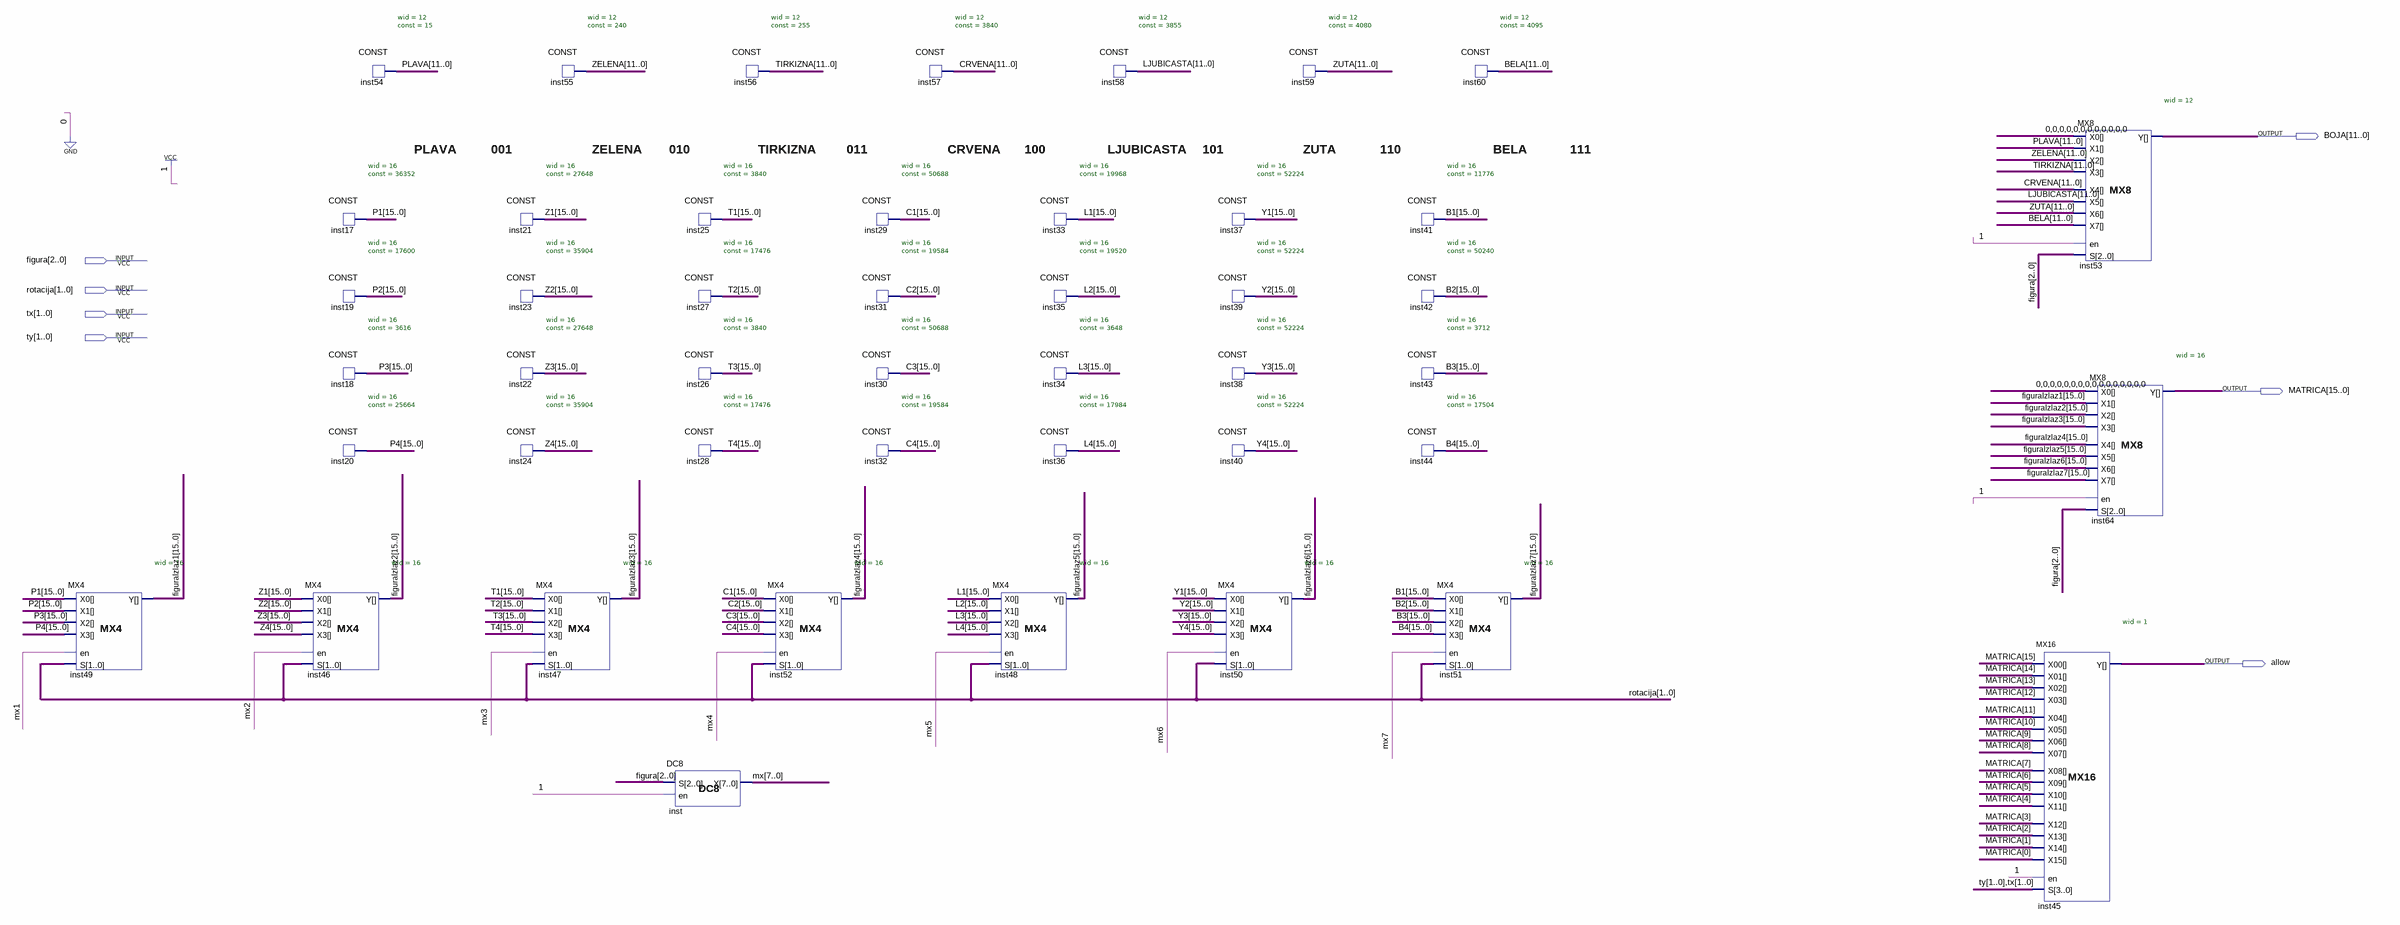
[diagram p0: schematic sheet]
// Quartus schematic Tetrimini.bdf as structural Verilog: 46 symbols, 7 pins
module Tetrimini (
  input  [2:0] figura,
  input  [1:0] rotacija,
  input  [1:0] tx,
  input  [1:0] ty,
  output [11:0] BOJA,
  output [15:0] MATRICA,
  output allow
);

  wire [7:0] mx;
  wire [11:0] BELA, CRVENA, LJUBICASTA, PLAVA, TIRKIZNA, ZELENA, ZUTA;
  wire [15:0] B1, B2, B3, B4, C1, C2, C3, C4, figuraIzlaz1, figuraIzlaz2, figuraIzlaz3, figuraIzlaz4,
       figuraIzlaz5, figuraIzlaz6, figuraIzlaz7, L1, L2, L3, L4, P1, P2, P3, P4, T1, T2, T3, T4, Y1, Y2, Y3,
       Y4, Z1, Z2, Z3, Z4;

  MX4 #(.wid(16)) inst49 (.X0(P1), .X1(P2), .X2(P3), .X3(P4), .en(mx[1]), .S(rotacija), .Y(figuraIzlaz1));
  CONST #(.wid(16), .\const (36352)) inst17 (.data(P1));
  CONST #(.wid(16), .\const (17600)) inst19 (.data(P2));
  CONST #(.wid(16), .\const (3616)) inst18 (.data(P3));
  CONST #(.wid(16), .\const (25664)) inst20 (.data(P4));
  MX4 #(.wid(16)) inst46 (.X0(Z1), .X1(Z2), .X2(Z3), .X3(Z4), .en(mx[2]), .S(rotacija), .Y(figuraIzlaz2));
  CONST #(.wid(12), .\const (15)) inst54 (.data(PLAVA));
  CONST #(.wid(16), .\const (27648)) inst21 (.data(Z1));
  CONST #(.wid(16), .\const (35904)) inst23 (.data(Z2));
  CONST #(.wid(16), .\const (27648)) inst22 (.data(Z3));
  CONST #(.wid(16), .\const (35904)) inst24 (.data(Z4));
  CONST #(.wid(12), .\const (240)) inst55 (.data(ZELENA));
  MX4 #(.wid(16)) inst47 (.X0(T1), .X1(T2), .X2(T3), .X3(T4), .en(mx[3]), .S(rotacija), .Y(figuraIzlaz3));
  DC8 inst (.S(figura), .en(1'b1), .X(mx));
  CONST #(.wid(16), .\const (3840)) inst25 (.data(T1));
  CONST #(.wid(16), .\const (17476)) inst27 (.data(T2));
  CONST #(.wid(16), .\const (3840)) inst26 (.data(T3));
  CONST #(.wid(16), .\const (17476)) inst28 (.data(T4));
  CONST #(.wid(12), .\const (255)) inst56 (.data(TIRKIZNA));
  MX4 #(.wid(16)) inst52 (.X0(C1), .X1(C2), .X2(C3), .X3(C4), .en(mx[4]), .S(rotacija), .Y(figuraIzlaz4));
  CONST #(.wid(16), .\const (50688)) inst29 (.data(C1));
  CONST #(.wid(16), .\const (19584)) inst31 (.data(C2));
  CONST #(.wid(16), .\const (50688)) inst30 (.data(C3));
  CONST #(.wid(16), .\const (19584)) inst32 (.data(C4));
  CONST #(.wid(12), .\const (3840)) inst57 (.data(CRVENA));
  MX4 #(.wid(16)) inst48 (.X0(L1), .X1(L2), .X2(L3), .X3(L4), .en(mx[5]), .S(rotacija), .Y(figuraIzlaz5));
  CONST #(.wid(16), .\const (19968)) inst33 (.data(L1));
  CONST #(.wid(16), .\const (19520)) inst35 (.data(L2));
  CONST #(.wid(16), .\const (3648)) inst34 (.data(L3));
  CONST #(.wid(16), .\const (17984)) inst36 (.data(L4));
  CONST #(.wid(12), .\const (3855)) inst58 (.data(LJUBICASTA));
  CONST #(.wid(16), .\const (52224)) inst37 (.data(Y1));
  CONST #(.wid(16), .\const (52224)) inst39 (.data(Y2));
  CONST #(.wid(16), .\const (52224)) inst38 (.data(Y3));
  CONST #(.wid(16), .\const (52224)) inst40 (.data(Y4));
  MX4 #(.wid(16)) inst50 (.X0(Y1), .X1(Y2), .X2(Y3), .X3(Y4), .en(mx[6]), .S(rotacija), .Y(figuraIzlaz6));
  CONST #(.wid(12), .\const (4080)) inst59 (.data(ZUTA));
  CONST #(.wid(16), .\const (11776)) inst41 (.data(B1));
  CONST #(.wid(16), .\const (50240)) inst42 (.data(B2));
  CONST #(.wid(16), .\const (3712)) inst43 (.data(B3));
  CONST #(.wid(16), .\const (17504)) inst44 (.data(B4));
  CONST #(.wid(12), .\const (4095)) inst60 (.data(BELA));
  MX4 #(.wid(16)) inst51 (.X0(B1), .X1(B2), .X2(B3), .X3(B4), .en(mx[7]), .S(rotacija), .Y(figuraIzlaz7));
  MX16 #(.wid(1)) inst45 (
    .X00(MATRICA[15]), .X01(MATRICA[14]), .X02(MATRICA[13]), .X03(MATRICA[12]), .X04(MATRICA[11]),
    .X05(MATRICA[10]), .X06(MATRICA[9]), .X07(MATRICA[8]), .X08(MATRICA[7]), .X09(MATRICA[6]),
    .X10(MATRICA[5]), .X11(MATRICA[4]), .X12(MATRICA[3]), .X13(MATRICA[2]), .X14(MATRICA[1]),
    .X15(MATRICA[0]), .en(1'b1), .S({ty, tx}), .Y(allow));
  MX8 #(.wid(12)) inst53 (
    .X0({12{1'b0}}), .X1(PLAVA), .X2(ZELENA), .X3(TIRKIZNA), .X4(CRVENA), .X5(LJUBICASTA), .X6(ZUTA),
    .X7(BELA), .en(1'b1), .S(figura), .Y(BOJA));
  MX8 #(.wid(16)) inst64 (
    .X0({16{1'b0}}), .X1(figuraIzlaz1), .X2(figuraIzlaz2), .X3(figuraIzlaz3), .X4(figuraIzlaz4),
    .X5(figuraIzlaz5), .X6(figuraIzlaz6), .X7(figuraIzlaz7), .en(1'b1), .S(figura), .Y(MATRICA));

  // Notes on the sheet:
  //   PLAVA
  //   001
  //   ZELENA
  //   010
  //   TIRKIZNA
  //   011
  //   CRVENA
  //   100
  //   LJUBICASTA
  //   101
  //   ZUTA
  //   110
  //   BELA
  //   111
endmodule
